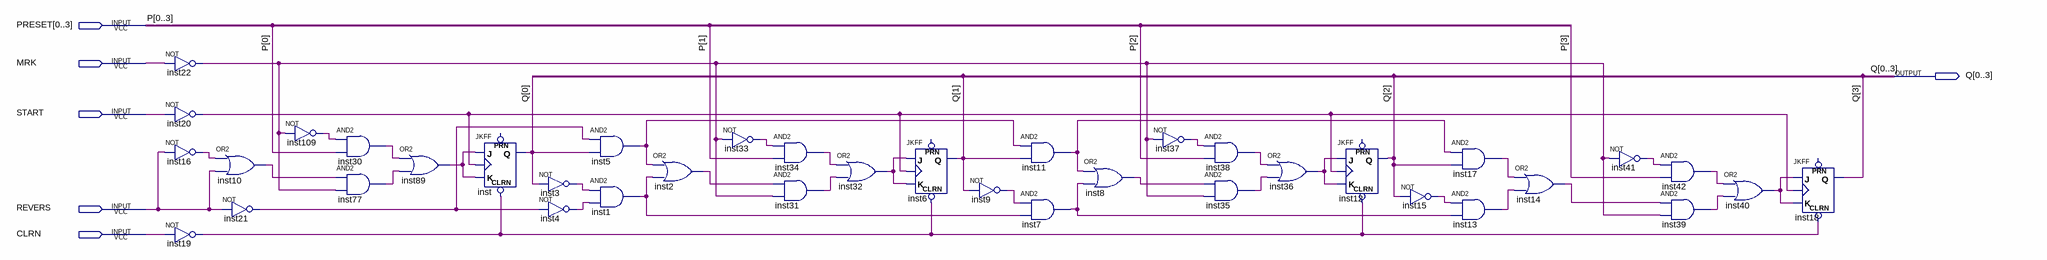
[diagram p0: schematic sheet]
// Quartus schematic reversff_with_preset.bdf as structural Verilog: 39 symbols, 6 pins
module reversff_with_preset (
  input  [0:3] PRESET,
  input  MRK,
  input  START,
  input  REVERS,
  input  CLRN,
  output [0:3] Q
);

  wire inst1_out, inst2_out, inst3_out, inst4_out, inst5_out, inst7_out, inst8_out, inst9_out, inst10_out,
       inst11_out, inst13_out, inst14_out, inst15_out, inst16_out, inst17_out, inst19_out, inst20_out,
       inst21_out, inst22_out, inst30_out, inst31_out, inst32_out, inst33_out, inst34_out, inst35_out,
       inst36_out, inst37_out, inst38_out, inst39_out, inst40_out, inst41_out, inst42_out, inst77_out,
       inst89_out, inst109_out;

  not inst22 (inst22_out, MRK);
  not inst20 (inst20_out, START);
  not inst16 (inst16_out, REVERS);
  not inst19 (inst19_out, CLRN);
  or inst10 (inst10_out, inst16_out, REVERS);
  not inst21 (inst21_out, REVERS);
  not inst109 (inst109_out, inst22_out);
  and inst30 (inst30_out, inst109_out, PRESET[0]);
  and inst77 (inst77_out, inst10_out, inst22_out);
  or inst89 (inst89_out, inst30_out, inst77_out);
  JKFF inst (.CLRN(inst19_out), .K(inst89_out), .J(inst89_out), .CLK(inst20_out), .Q(Q[0]));  // open: PRN
  not inst3 (inst3_out, Q[0]);
  not inst4 (inst4_out, inst21_out);
  and inst5 (inst5_out, inst21_out, Q[0]);
  and inst1 (inst1_out, inst3_out, inst4_out);
  or inst2 (inst2_out, inst5_out, inst1_out);
  not inst33 (inst33_out, inst22_out);
  and inst34 (inst34_out, inst33_out, PRESET[1]);
  and inst31 (inst31_out, inst2_out, inst22_out);
  or inst32 (inst32_out, inst34_out, inst31_out);
  JKFF inst6 (.CLRN(inst19_out), .K(inst32_out), .J(inst32_out), .CLK(inst20_out), .Q(Q[1]));  // open: PRN
  not inst9 (inst9_out, Q[1]);
  and inst11 (inst11_out, inst5_out, Q[1]);
  and inst7 (inst7_out, inst9_out, inst1_out);
  or inst8 (inst8_out, inst11_out, inst7_out);
  not inst37 (inst37_out, inst22_out);
  and inst38 (inst38_out, inst37_out, PRESET[2]);
  and inst35 (inst35_out, inst8_out, inst22_out);
  or inst36 (inst36_out, inst38_out, inst35_out);
  JKFF inst12 (.CLRN(inst19_out), .K(inst36_out), .J(inst36_out), .CLK(inst20_out), .Q(Q[2]));  // open: PRN
  not inst15 (inst15_out, Q[2]);
  and inst17 (inst17_out, inst11_out, Q[2]);
  and inst13 (inst13_out, inst15_out, inst7_out);
  or inst14 (inst14_out, inst17_out, inst13_out);
  not inst41 (inst41_out, inst22_out);
  and inst42 (inst42_out, inst41_out, PRESET[3]);
  and inst39 (inst39_out, inst14_out, inst22_out);
  or inst40 (inst40_out, inst42_out, inst39_out);
  JKFF inst18 (.CLRN(inst19_out), .K(inst40_out), .J(inst40_out), .CLK(inst20_out), .Q(Q[3]));  // open: PRN

  // Other names for the same wires on the sheet: P[3:0] = {PRESET[3], PRESET[2], PRESET[1], PRESET[0]}
endmodule
